# Altium schematic sheet data_interface.SchDoc
size A4; SheetNumber: 3; SheetTotal: 7
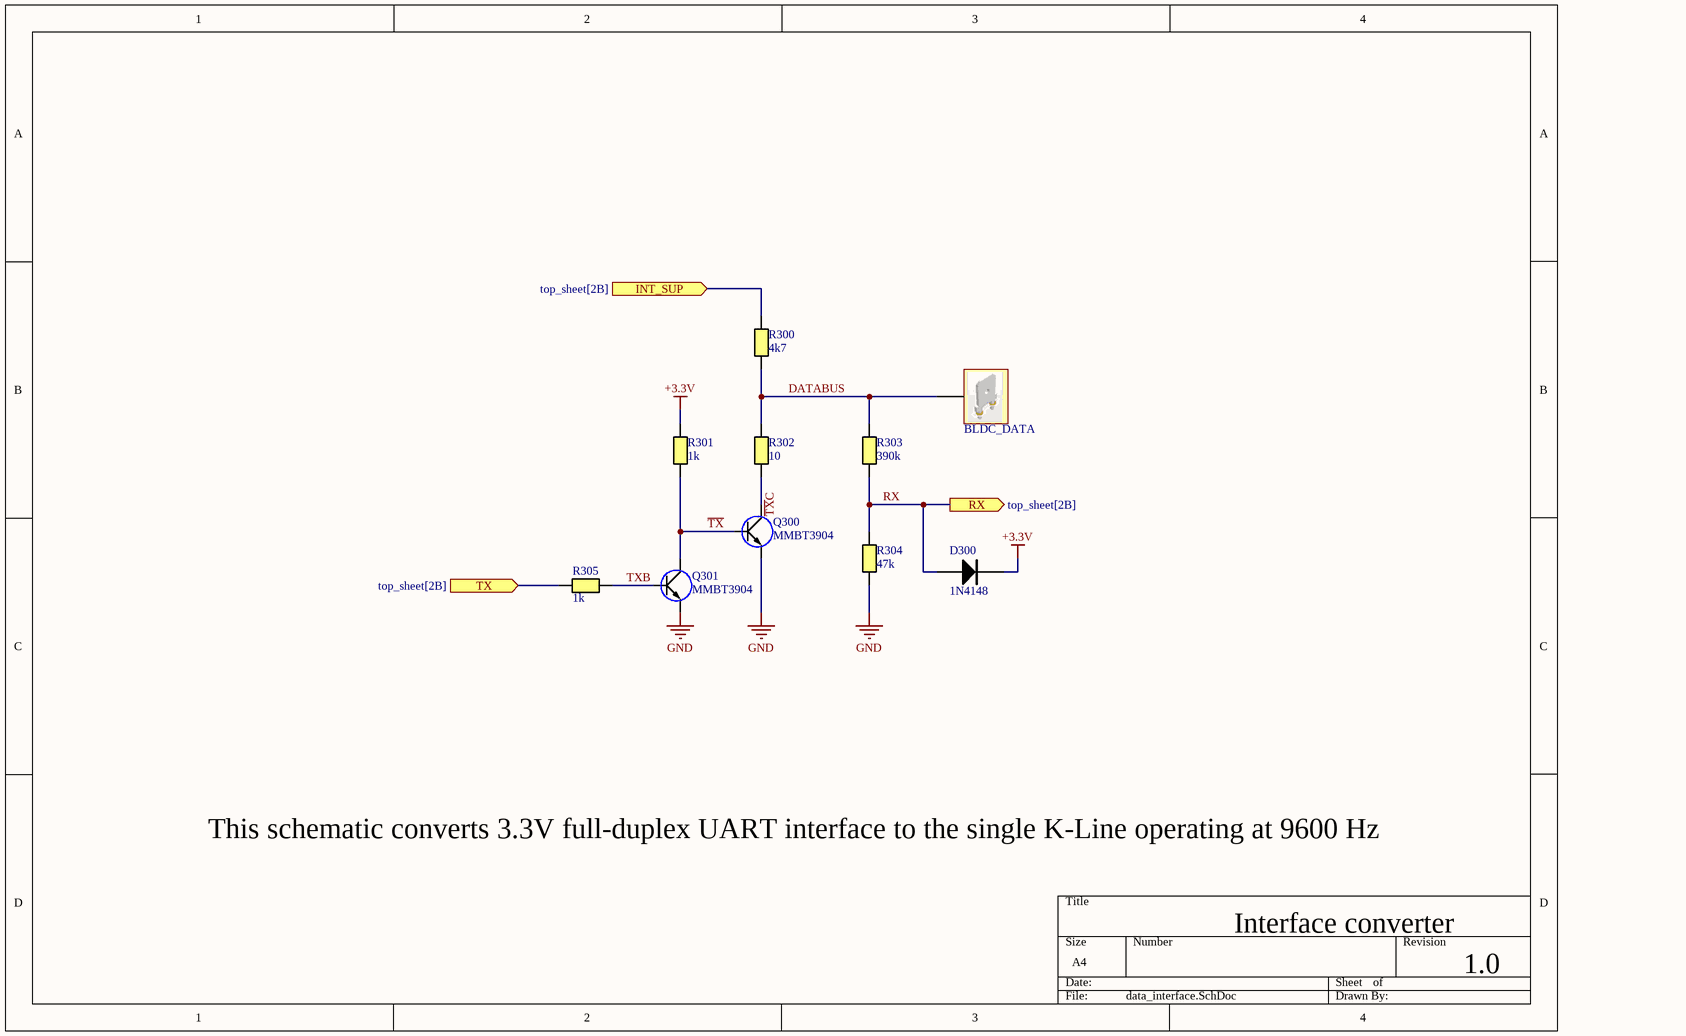
[diagram p0: data_interface.SchDoc]

## Parts
BLDC_DATA  Crimp 6.3 single PCB  [Crimp 6.3mm single PCB]  (value not drawn)
D300  1N4148  [SOD80]
Q300  MMBT3904  [SOT23]
Q301  MMBT3904  [SOT23]
R300  4k7  [RESC0603(1608)_N]
R301  1k  [RESC0603(1608)_N]
R302  10  [RESC0603(1608)_N]
R303  390k  [RESC0603(1608)_N]
R304  47k  [RESC0603(1608)_N]
R305  1k  [RESC0603(1608)_N]

## Ports
INT_SUP (in, see top_sheet[2B]), RX (out, see top_sheet[2B]), TX (in, see top_sheet[2B])

## Nets
+3.3V: D300.2(K) R301.2
GND: Q300.2(E) Q301.2(E) R304.1
DATABUS: BLDC_DATA.1 R300.1 R302.2 R303.2
INT_SUP: R300.2 ; port INT_SUP
RX: D300.1(A) R303.1 R304.2 ; port RX
~{TX}: Q300.1(B) Q301.3(C) R301.1
~{TX}C: Q300.3(C) R302.1
TX: R305.1 ; port TX
TXB: Q301.1(B) R305.2

## Notes on the sheet
- This schematic converts 3.3V full-duplex UART interface to the single K-Line operating at 9600 Hz
- Interface converter
- 1.0

## Library data of the parts
BLDC_DATA = Crimp 6.3 single PCB: Straight Mount Angle PCB Tab Terminal
D300 = 1N4148: Small Signal Fast Switching Diodes; Repetitive peak reverse voltage: 100 V; Reverse voltage: 75 V; Peak forward surge current: 2 A; Repetitive peak forward current: 500 mA; Forward continuous current: 300 mA; Average forward current: 150 mA; Diode capacitance: 4 pF; Reverse recovery time: 4 ~ 8 ns; Supplier 1: Mouser; Supplier Part Number 1: 78-MCL4148
Q300 Q301 = 2N3904: NPN General Purpose Transistor; Collector-Emitter Voltage: 40V; Collector-Base Voltage: 60V; Collector Current - Continuous: 200mA; DC Current Gain: 300
R300-R305 = Resistor M: Resistor Medium Density
  R300: Value: 4k7
  R301 R305: Value: 1k
  R302: Value: 10
  R303: Value: 390k
  R304: Value: 47k